# Altium schematic sheet Sheet1.SchDoc
size 549 x 449 mm; SheetNumber: 1; SheetTotal: 1
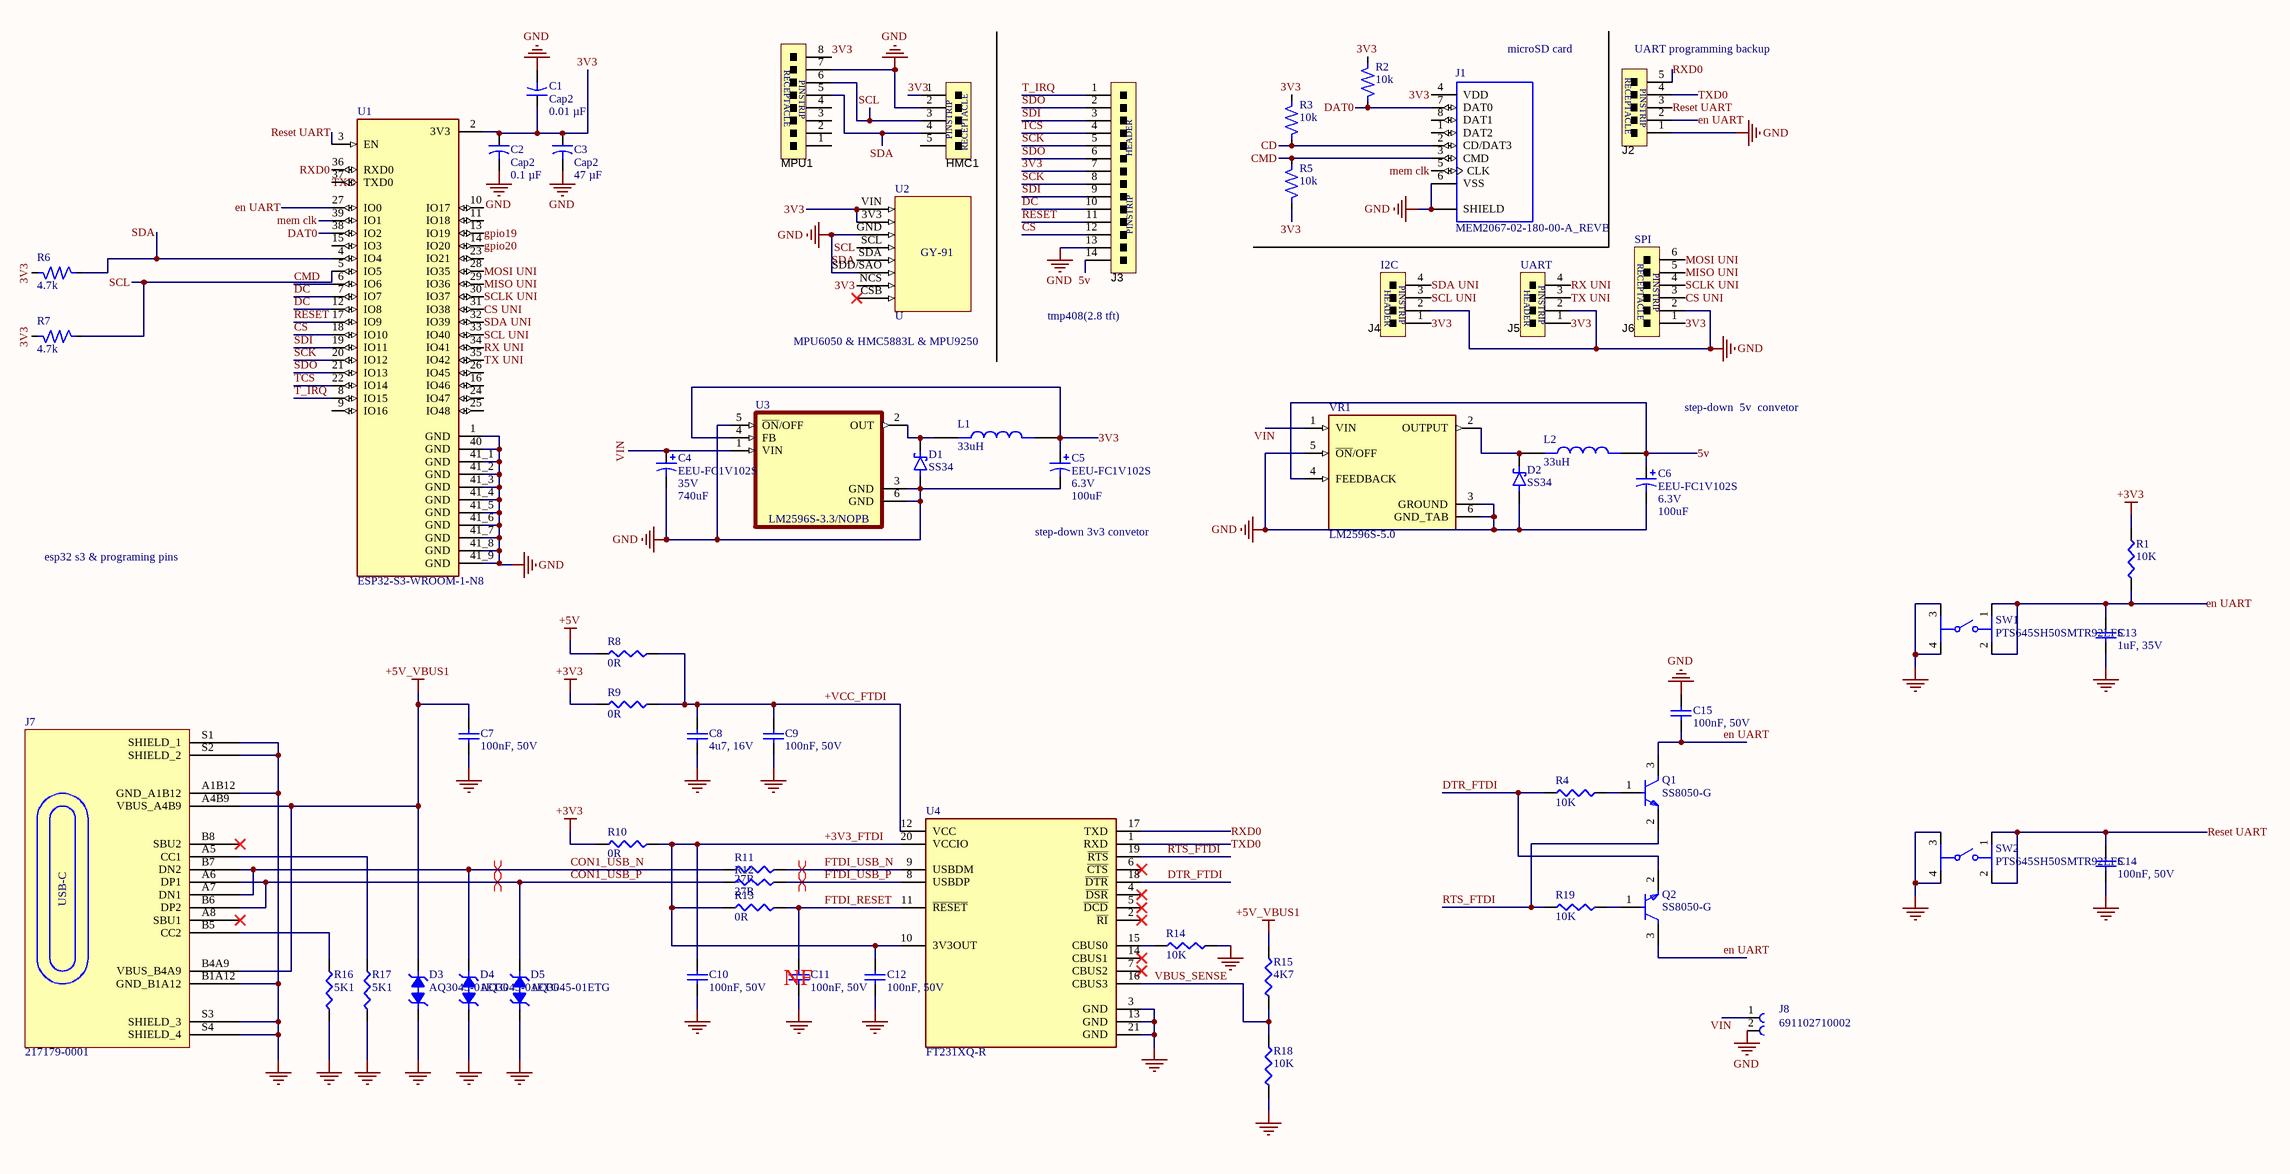
[diagram p0: Sheet1.SchDoc]

## Parts
C1  Cap2  value 0.01 µF  [CAPR5-4X5]
C2  Cap2  value 0.1 µF  [CAPR5-4X5]
C3  Cap2  value 47 µF  [CAPR5-4X5]
C4  EEU-FC1V102S  value 740uF  VoltageDC: 35V  [THRU-KMG-L25]
C5  EEU-FC1V102S  value 100uF  VoltageDC: 6.3V  [THRU-KMG-L25]
C6  EEU-FC1V102S  value 100uF  VoltageDC: 6.3V  [THRU-KMG-L25]
C7  100nF, 50V  [CAPC1005X55N]
C8  4u7, 16V  [CAPC1005X55N]
C9  100nF, 50V  [CAPC1005X55N]
C10  100nF, 50V  [CAPC1005X55N]
C11  100nF, 50V  [CAPC1005X55N]
C12  100nF, 50V  [CAPC1005X55N]
C13  1uF, 35V  [CAPC1005X55N]
C14  100nF, 50V  [CAPC1005X55N]
C15  100nF, 50V  [CAPC1005X55N]
D1  SS34  [DIO_SS34]
D2  SS34  [DIO_SS34]
D3  AQ3045-01ETG  [SOD882]
D4  AQ3045-01ETG  [SOD882]
D5  AQ3045-01ETG  [SOD882]
HMC1  5-534237-3  [PINSTRIP-SINGLE-5PIN-.1]  (value not drawn)
J1  MEM2067-02-180-00-A_REVB  [GCT_MEM2067-02-180-00-A_REVB]
J2  5-534237-3  [PINSTRIP-SINGLE-5PIN-.1]  (value not drawn)
J3  9-146285-0  [PINSTRIP-SINGLE-14PIN-.1]  (value not drawn)
J4  9-146285-0  [PINSTRIP-SINGLE-4PIN-.1]  (value not drawn)
J5  9-146285-0  [PINSTRIP-SINGLE-4PIN-.1]  (value not drawn)
J6  5-534237-4  [PINSTRIP-SINGLE-6PIN-.1]  (value not drawn)
J7  217179-0001  [FP-2171790001-MFG]
J8  691102710002  [*691102710002]
L1  33uH  [IND_FIT68-5]
L2  33uH  [IND_FIT68-5]
MPU1  5-534237-6  [PINSTRIP-SINGLE-8PIN-.1]  (value not drawn)
Q1  SS8050-G  [FP-SS8050-G-IPC_B]
Q2  SS8050-G  [FP-SS8050-G-IPC_B]
R1  10K  [RESC1005X37N]
R2  value 10k  [R0805]  (hidden comment: 1.5kR, 0805)
R3  value 10k  [R0805]  (hidden comment: 1.5kR, 0805)
R4  10K  [RESC1005X37N]
R5  value 10k  [R0805]  (hidden comment: 1.5kR, 0805)
R6  value 4.7k  [R0805]  (hidden comment: 1.5kR, 0805)
R7  value 4.7k  [R0805]  (hidden comment: 1.5kR, 0805)
R8  0R  [RESC1005X37N]
R9  0R  [RESC1005X37N]
R10  0R  [RESC1005X37N]
R11  27R  [RESC1005X37N]
R12  27R  [RESC1005X37N]
R13  0R  [RESC1005X37N]
R14  10K  [RESC1005X37N]
R15  4K7  [RESC1005X37N]
R16  5K1  [RESC1005X37N]
R17  5K1  [RESC1005X37N]
R18  10K  [RESC1005X37N]
R19  10K  [RESC1005X37N]
SW1  PTS645SH50SMTR92LFS  [FP-PTS645SH50SMTR92LFS-MFG]
SW2  PTS645SH50SMTR92LFS  [FP-PTS645SH50SMTR92LFS-MFG]
U1  ESP32-S3-WROOM-1-N8  [XCVR_ESP32-S3-WROOM-1-N8]
U2  U  [GY-91]
U3  LM2596S-3.3/NOPB  [VREG_LM2596S-3.3/NOPB]
U4  FT231XQ-R  [FP-QFN-20-IPC_B]
VR1  LM2596S-5.0  [TO170P1524X483-6N]

## Nets
+3V3: R1.2 R9.1 R10.1
+5V: R8.1
+5V_VBUS1: C7.2 D3.2 J7.A4B9(VBUS_A4B9) J7.B4A9(VBUS_B4A9) R15.2
GND: C1.2 C2.2 C3.2 C4.2 C5.2 C6.2 C7.1 C8.1 C9.1 C10.1 C11.1 C12.1 C13.1 C14.1 C15.2 D1.A D2.A D3.1 D4.1 D5.1 HMC1.2(GND) J1.6(VSS) J1.9(SHIELD) J1.10(SHIELD) J1.11(SHIELD) J1.12(SHIELD) J2.1 J3.13 J4.2 J5.2 J6.2 J7.A1B12(GND_A1B12) J7.B1A12(GND_B1A12) J7.S1(SHIELD_1) J7.S2(SHIELD_2) J7.S3(SHIELD_3) J7.S4(SHIELD_4) J8.2 MPU1.7 R14.2 R16.1 R17.1 R18.2 SW1.3 SW1.4 SW2.3 SW2.4 U1.1(GND) U1.40(GND) U1.41_1(GND) U1.41_2(GND) U1.41_3(GND) U1.41_4(GND) U1.41_5(GND) U1.41_6(GND) U1.41_7(GND) U1.41_8(GND) U1.41_9(GND) U2.GND U2.SDD/SAO U3.3(GND) U3.5(~{ON}/OFF) U3.6(GND) U4.3(GND) U4.13(GND) U4.21(GND) VR1.3(GROUND) VR1.5(~{ON}/OFF) VR1.6(GND_TAB)
3V3: C1.1 C2.1 C3.1 C5.1 HMC1.1(Vcc) J1.4(VDD) J3.7 J4.1 J5.1 J6.1 L1.2 MPU1.8 R2.2 R3.2 R5.1 R6.1 R7.1 U1.2(3V3) U2.3V3 U2.NCS U2.VIN U3.4(FB)
5v: C6.1 J3.14 L2.2 VR1.4(FEEDBACK)
+3V3_FTDI: C10.2 C12.2 R10.2 R13.1 U4.10(3V3OUT) U4.20(VCCIO)
+VCC_FTDI: C8.2 C9.2 R8.2 R9.2 U4.12(VCC)
CD: J1.2(CD/DAT3) R3.1
CMD: J1.3(CMD) R5.2 U1.6(IO6)
CON1_USB_N: D4.2 J7.A7(DN1) J7.B7(DN2) R11.1
CON1_USB_P: D5.2 J7.A6(DP1) J7.B6(DP2) R12.1
CS: J3.12 U1.18(IO10)
CS UNI: J6.3 U1.31(IO38)
DAT0: J1.7(DAT0) R2.1 U1.38(IO2)
DC: J3.10 U1.7(IO7) U1.12(IO8)
DTR_FTDI: Q2.2(E) R4.1 U4.18(~{DTR})
en UART: C13.2 C15.1 J2.2 Q1.3(C) Q2.3(C) R1.1 SW1.1 SW1.2 U1.27(IO0)
FTDI_RESET: C11.2 R13.2 U4.11(~{RESET})
FTDI_USB_N: R11.2 U4.9(USBDM)
FTDI_USB_P: R12.2 U4.8(USBDP)
gpio19: U1.13(IO19)
gpio20: U1.14(IO20)
mem clk: J1.5(CLK) U1.39(IO1)
MISO UNI: J6.5 U1.29(IO36)
MOSI UNI: J6.6 U1.28(IO35)
RESET: J3.11 U1.17(IO9)
Reset UART: C14.2 J2.3 SW2.1 SW2.2 U1.3(EN)
RTS_FTDI: Q1.2(E) R19.1 U4.19(~{RTS})
RX UNI: J5.4 U1.34(IO41)
RXD0: J2.5 U1.36(RXD0) U4.17(TXD)
SCK: J3.5 J3.8 U1.20(IO12)
SCL: HMC1.3(SCL) MPU1.6 R7.2 U1.5(IO5) U2.SCL
SCL UNI: J4.3 U1.33(IO40)
SCLK UNI: J6.4 U1.30(IO37)
SDA: HMC1.4(SDA) MPU1.5 R6.2 U1.4(IO4) U2.SDA
SDA UNI: J4.4 U1.32(IO39)
SDI: J3.3 J3.9 U1.19(IO11)
SDO: J3.2 J3.6 U1.21(IO13)
T_IRQ: J3.1 U1.8(IO15)
TCS: J3.4 U1.22(IO14)
TX UNI: J5.3 U1.35(IO42)
TXD0: J2.4 U1.37(TXD0) U4.1(RXD)
VBUS_SENSE: R15.1 R18.1 U4.16(CBUS3)
VIN: C4.1 J8.1 U3.1(VIN) VR1.1(VIN)
NetD1_C: D1.C(K) L1.1 U3.2(OUT)
NetD2_C: D2.C(K) L2.1 VR1.2(OUTPUT)
NetJ7_A5: J7.A5(CC1) R17.2
NetJ7_B5: J7.B5(CC2) R16.2
NetQ1_1: Q1.1(B) R4.2
NetQ2_1: Q2.1(B) R19.2
NetR14_1: R14.1 U4.15(CBUS0)

Not connected (* = marked no-connect by the designer): HMC1 5(DRDY); J1 1(DAT2) 8(DAT1); J7 A8(SBU1)* B8(SBU2)*; MPU1 1 2 3 4; U1 9(IO16) 10(IO17) 11(IO18) 15(IO3) 16(IO46) 23(IO21) 24(IO47) 25(IO48) 26(IO45); U2 CSB*; U4 2(~{RI})* 4(~{DSR})* 5(~{DCD})* 6(~{CTS})* 7(CBUS2)* 14(CBUS1)*

## Layout directives
differential pair; differential pair class DIFF90: CON1_USB_N, CON1_USB_P, FTDI_USB_N, FTDI_USB_P

## Notes on the sheet
- microSD card
- (near J2) UART programming backup
- (near J4) I2C
- (near J5) UART
- (near J6) SPI
- (near U2) MPU6050 & HMC5883L & MPU9250
- tmp408(2.8 tft)
- step-down  5v  convetor
- step-down 3v3 convetor
- esp32 s3 & programing pins
- (near C11) NF
- (in symbol 217179-0001) USB-C
- (in symbol PINSTRIP-HDR-SINGLE-4pin) HEADER; PINSTRIP
- (in symbol PINSTRIP-HDR-SINGLE-14pin) HEADER; PINSTRIP
- (in symbol PINSTRIP-RCPT-SINGLE-5pin) PINSTRIP; RECEPTACLE
- (in symbol PINSTRIP-RCPT-SINGLE-6pin) RECEPTACLE; PINSTRIP
- (in symbol PINSTRIP-RCPT-SINGLE-8pin) RECEPTACLE; PINSTRIP

## Library data of the parts
C1-C3 = Cap2: Capacitor; Published: 23-Sep-2002; PackageReference: CAPR5-4X5; Publisher: Altium Limited; PackageDescription: Capacitor; 2 Leads
C4-C6 = 1000uF: 1000uF, Alum Electrolytic Capacitor, 35V, 16mm x 20mm, lead spacing 7.5mm; Manufacturer: Panasonic; Impedance: 29mOhm; Part Number: EEU-FC1V102S; PackageDescription: Aluminum Electrolytic Capacitor; Temperature: -55C to 105C; Voltage (DC): *; Supplier 1: Digi-Key; Supplier Part Number 1: P10876-ND; Supplier 2: Newark; Supplier Part Number 2: 17T5114; Supplier 3: Mouser; Supplier Part Number 3: 667-EEU-FC1V102SB; Package Reference: Thru-Hole, 7.5mm
C7 C9-C12 C14 C15 = CL05B104KB54PNC: CAP CER 0.1UF 50V X7R 0402; Manufacturer: Samsung; Dielectric Material: Ceramic; Supplier: Digikey; Supplier Part Number: 1276-CL05B104KB54PNCCT-ND; Manufacturer Part Number: CL05B104KB54PNC; RoHS: Yes; Category: Ceramic Capacitors; Stock: 1237875; Pricing: 1=0.1, 10=0.044, 50=0.025, 100=0.0194, 500=0.0146, 1000=0.01147, 2500=0.01043, 5000=0.00959 (USD); Pins: 2; Capacitor Type: Ceramic; RoHS Compliant: Yes; Reach SVHC Compliant: Yes; ComponentLink1URL: https://datasheet.ciiva.com:443/pdfs/VipMasterIC/IC/SEMS/SEMS-S-A0006318249/SEMS-S-A0006320959-1.pdf?src-supplier=IHS+Markit; ComponentLink1Description: https://datasheet.ciiva.com:443/pdfs/VipMasterIC/IC/SEMS/SEMS-S-A0006318249/SEMS-S-A0006320959-1.pdf?src-supplier=IHS+Markit; ComponentLink2URL: https://datasheet.octopart.com/CL05B104KB54PNC-Samsung-datasheet-8326407.pdf?src-supplier=TME; ComponentLink2Description: https://datasheet.octopart.com/CL05B104KB54PNC-Samsung-datasheet-8326407.pdf?src-supplier=TME; LCSC Part Number: C307331
C8 = CL05A475MO5NUNC: CAP CER 4.7UF 16V X5R 0402; Manufacturer: Samsung; Dielectric Material: Ceramic; Multilayer: Yes; Tolerance  (fill in as +-): 20%; Supplier: Digikey; Supplier Part Number: 1276-6836-1-ND; Manufacturer Part Number: CL05A475MO5NUNC; RoHS: Yes; Category: Ceramic Capacitors; Stock: 647617; Pricing: 1=0.44, 10=0.293, 50=0.216, 100=0.1759, 500=0.13888, 1000=0.11727, 2500=0.1111, 5000=0.10493 (USD); Mounting Technology: Surface Mount; Pins: 2; Package Shape: Rectangular; Case/Package: 0402; Terminal Finish: Nickel; Min Operating Temperature: -55°C; Max Operating Temperature: 85°C; JESD-609 Code: e3; Value: 4.7uF; Capacitor Type: Ceramic; Package Style: SMTMeter; Packaging: Tape and Reel; Tolerance (fill in as +-): 20%; Rated DC Voltage (URdc): 16V; Temperature Characteristics Code: X5R; Termination: Wraparound; Length: 1mm; Width: 0.5mm; Height: 0.7mm; Reach SVHC Compliant: Yes; RoHS Compliant: Yes; ComponentLink1URL: https://datasheet.ciiva.com:443/pdfs/VipMasterIC/IC/SEMS/SEMS-S-A0008384515/SEMS-S-A0008898881-1.pdf?src-supplier=IHS+Markit; ComponentLink1Description: https://datasheet.ciiva.com:443/pdfs/VipMasterIC/IC/SEMS/SEMS-S-A0008384515/SEMS-S-A0008898881-1.pdf?src-supplier=IHS+Markit; ComponentLink2URL: http://www.farnell.com/datasheets/2710653.pdf?src-supplier=Farnell; ComponentLink2Description: http://www.farnell.com/datasheets/2710653.pdf?src-supplier=Farnell; ComponentLink3URL: http://www.samsungsem.com/kr/support/product-search/mlcc/CL05A475MO5NUNC.jsp?src-supplier=Digikey; ComponentLink3Description: http://www.samsungsem.com/kr/support/product-search/mlcc/CL05A475MO5NUNC.jsp?src-supplier=Digikey; ComponentLink4URL: http://www.farnell.com/datasheets/2710653.pdf?src-supplier=Newark; ComponentLink4Description: http://www.farnell.com/datasheets/2710653.pdf?src-supplier=Newark; ComponentLink5URL: http://www.farnell.com/datasheets/2710653.pdf?src-supplier=Element14; ComponentLink5Description: http://www.farnell.com/datasheets/2710653.pdf?src-supplier=Element14; ComponentLink6URL: https://datasheet.octopart.com/CL05A475MO5NUNC-Samsung-Electro-Mechanics-datasheet-123102911.pdf?src-supplier=Future+Electronics; ComponentLink6Description: https://datasheet.octopart.com/CL05A475MO5NUNC-Samsung-Electro-Mechanics-datasheet-123102911.pdf?src-supplier=Future+Electronics; LCSC Part Number: C318563
C13 = CL05A105KL5NRNC: CAP CER 1UF 35V X5R 0402; Manufacturer: Samsung; Dielectric Material: Ceramic; Multilayer: Yes; Tolerance  (fill in as +-): 10%; Supplier: Digikey; Supplier Part Number: 1276-6796-1-ND; Manufacturer Part Number: CL05A105KL5NRNC; RoHS: Yes; Category: Ceramic Capacitors; Stock: 469958; Pricing: 1=0.33, 10=0.212, 50=0.149, 100=0.1202, 500=0.08934, 1000=0.07818, 2500=0.07446, 5000=0.06887 (USD); Mounting Technology: Surface Mount; Pins: 2; Package Shape: Rectangular; Case/Package: 0402; Terminal Finish: Nickel; Min Operating Temperature: -55°C; Max Operating Temperature: 85°C; JESD-609 Code: e3; Value: 1uF; Capacitor Type: Ceramic; Packaging: Tape and Reel; Tolerance (fill in as +-): 10%; Rated DC Voltage (URdc): 35V; Temperature Characteristics Code: X5R; Termination: Wraparound; Reach SVHC Compliant: Yes; RoHS Compliant: Yes; ComponentLink1URL: https://datasheet.ciiva.com:443/pdfs/VipMasterIC/IC/SEMS/SEMS-S-A0008384515/SEMS-S-A0008872905-1.pdf?src-supplier=IHS+Markit; ComponentLink1Description: https://datasheet.ciiva.com:443/pdfs/VipMasterIC/IC/SEMS/SEMS-S-A0008384515/SEMS-S-A0008872905-1.pdf?src-supplier=IHS+Markit; ComponentLink2URL: http://www.samsungsem.com/kr/support/product-search/mlcc/CL05A105KL5NRNC.jsp?src-supplier=Digikey; ComponentLink2Description: http://www.samsungsem.com/kr/support/product-search/mlcc/CL05A105KL5NRNC.jsp?src-supplier=Digikey; LCSC Part Number: C307413
D1 D2 = SS34: 3A, 40V, Schottky Rectifier; MF: Taiwan Semiconductor; SnapEDA_Link: https://www.snapeda.com/parts/SS34/Taiwan+Semiconductor/view-part/?ref=snap; Package: DO-214AB-2 Taiwan Semiconductor; Value: *; MP: SS34; Check_prices: https://www.snapeda.com/parts/SS34/Taiwan+Semiconductor/view-part/?ref=eda
D3-D5 = AQ3045-01ETG: TVS DIODE 5.3VWM 12VC SOD882; Manufacturer: Littelfuse; Diode Element Material: SILICON; Package Body Material: Plastic; Polarity: Bidirectional; Max Breakdown Voltage: 9V; Min Breakdown Voltage: 6.8V; Diode Type: TRANS VOLTAGE SUPPRESSOR; Non-rep Peak Rev Power Dis-Max: 40W; Number of Elements: 1; Rep Pk Reverse Voltage-Max: 5.3V; Reference Standard: AEC-Q101; Supplier: Digikey; Supplier Part Number: F9321CT-ND; Manufacturer Part Number: AQ3045-01ETG; RoHS: Yes; Category: TVS Diodes; Stock: 21664; Pricing: 1=0.5, 10=0.391, 100=0.2344, 500=0.217, 1000=0.14756, 2000=0.13585, 5000=0.1302 (USD); Pins: 2; Package Shape: Rectangular; Min Operating Temperature: -55°C; Max Operating Temperature: 150°C; Package Style: CHIP CARRIERMeter; Surface Mount: Yes; Technology: AVALANCHE; Terminal Form: No Lead; Terminal Position: BOTTOM; Reach SVHC Compliant: Yes; RoHS Compliant: Yes; ComponentLink1URL: https://datasheet.ciiva.com:443/pdfs/VipMasterIC/IC/LFSI/LFSI-S-A0007892042/LFSI-S-A0007892042-1.pdf?src-supplier=IHS+Markit; ComponentLink1Description: https://datasheet.ciiva.com:443/pdfs/VipMasterIC/IC/LFSI/LFSI-S-A0007892042/LFSI-S-A0007892042-1.pdf?src-supplier=IHS+Markit; ComponentLink2URL: https://www.littelfuse.com/~/media/electronics/datasheets/tvs_diode_arrays/littelfuse_tvs_diode_array_aq3045_datasheet.pdf.pdf?src-supplier=Digikey; ComponentLink2Description: https://www.littelfuse.com/~/media/electronics/datasheets/tvs_diode_arrays/littelfuse_tvs_diode_array_aq3045_datasheet.pdf.pdf?src-supplier=Digikey; ComponentLink3URL: http://www.littelfuse.com/~/media/electronics/datasheets/tvs_diode_arrays/littelfuse_tvs_diode_array_aq3045_datasheet.pdf.pdf?src-supplier=Digikey; ComponentLink3Description: http://www.littelfuse.com/~/media/electronics/datasheets/tvs_diode_arrays/littelfuse_tvs_diode_array_aq3045_datasheet.pdf.pdf?src-supplier=Digikey; LCSC Part Number: C3710326
HMC1 J2 = PINSTRIP-RCPT-SINGLE-5pin: 5 Pin Receptacle, Single row, 2.54mm pitch, Vertical; Manufacturer: TE Connectivity; Pitch: 0.100" (2.54mm); Rows: 1; Mates With (PCB): PINSTRIP-HDR-SINGLE-5pin; Connector Height: 320 mil; Mounting Type: Through Hole; PackageDescription: Pin Receptacle; 2.54mm pitch; Part Number: 5-534237-3; Pins: 5; Mates With (Wire housing): N/A; Supplier 1: Mouser; Supplier Part Number 1: 571-5-534237-3; Supplier 2: Newark; Supplier Part Number 2: 18R9351; Supplier 3: Digi-Key; Supplier Part Number 3: A32906-ND
J1 = MEM2067-02-180-00-A_REVB: Micro SD Memory Card ConnectorSMT, Hinged, 1.80mm Profile; Price: None; Value: *; MP: MEM2067-02-180-00-A_REVB; Package: None; Availability: Unavailable
J3 = PINSTRIP-HDR-SINGLE-14pin: 14 Pin Header, Single row, 2.54mm pitch, Unshrouded Pin Strip, Vertical; Manufacturer: TE Connectivity; Part Number: 14/40 of 9-146285-0; Pitch: 0.100" (2.54mm); Rows: 1; Mates With (PCB): 6-534237-2; Mates With (Wire housing): 50-57-9014 (MOLEX Part, Uses crimp terminal series 70058, 71851, 70021); Connector Height: 320 mil; Mounting Type: Through Hole; PackageDescription: Pin header; 2.54mm pitch; Pins: 14; Supplier 1: Digi-Key; Supplier 2: Newark; Supplier 3: Mouser; Supplier Part Number 1: A32700-40-ND; Supplier Part Number 2: 16M3463; Supplier Part Number 3: 571-9-146285-0
J4 J5 = PINSTRIP-HDR-SINGLE-4pin: 4 Pin Header, Single row, 2.54mm pitch, Unshrouded Pin Strip, Vertical; Manufacturer: TE Connectivity; Part Number: 04/40 of 9-146285-0; Pitch: 0.100" (2.54mm); Rows: 1; Mates With (PCB): 5-534237-2; Mates With (Wire housing): 50-57-9004 (MOLEX Part, Uses crimp terminal series 70058, 71851, 70021); Connector Height: 320 mil; Mounting Type: Through Hole; PackageDescription: Pin header; 2.54mm pitch; Pins: 4; Supplier 1: Digi-Key; Supplier 2: Newark; Supplier 3: Mouser; Supplier Part Number 1: A32700-40-ND; Supplier Part Number 2: 16M3463; Supplier Part Number 3: 571-9-146285-0
J6 = PINSTRIP-RCPT-SINGLE-6pin: 6 Pin Receptacle, Single row, 2.54mm pitch, Vertical; Manufacturer: TE Connectivity; Pitch: 0.100" (2.54mm); Rows: 1; Mates With (PCB): PINSTRIP-HDR-SINGLE-6pin; Connector Height: 320 mil; Mounting Type: Through Hole; PackageDescription: Pin Receptacle; 2.54mm pitch; Part Number: 5-534237-4; Pins: 6; Mates With (Wire housing): N/A; Supplier 1: Digi-Key; Supplier Part Number 1: A32907-ND; Supplier 2: Newark; Supplier Part Number 2: 62M8851; Supplier 3: Mouser; Supplier Part Number 3: 571-5-534237-4
J7 = 217179-0001: CONN RCP USB2.0 TYP C 24P SMD RA; Manufacturer: Molex; Supplier: Digikey; Supplier Part Number: 900-2171790001CT-ND; Manufacturer Part Number: 217179-0001; RoHS: No; Category: Connectors; Stock: 7228; Pricing: 1=0.9, 10=0.745, 100=0.6212 (USD); LCSC Part Number: C3197684
J8 = 691102710002: 102 Series 5mm Pitch Straight, PCB Terminal Block, Through Hole, 2 Way; MF: Wurth Electronics; Package: None; MP: 691102710002; SnapEDA_Link: https://www.snapeda.com/parts/691102710002/Wurth%20Electronics%20Inc./view-part/?ref=snap; Availability: Unavailable; Price: None; Value: *
L1 L2 = FIT68-5: 33.15 ÂµH Unshielded Toroidal Inductor 5.7 A 28.8mOhm Max Radial, Vertical (Open); MF: Triad Magnetics; SnapEDA_Link: https://www.snapeda.com/parts/FIT68-5/Triad+Magnetics/view-part/?ref=snap; Package: None; Value: *; MP: FIT68-5; Check_prices: https://www.snapeda.com/parts/FIT68-5/Triad+Magnetics/view-part/?ref=eda
MPU1 = PINSTRIP-RCPT-SINGLE-8pin: 8 Pin Receptacle, Single row, 2.54mm pitch, Vertical; Manufacturer: TE Connectivity; Pitch: 0.100" (2.54mm); Rows: 1; Mates With (PCB): PINSTRIP-HDR-SINGLE-8pin; Connector Height: 320 mil; Mounting Type: Through Hole; PackageDescription: Pin Receptacle; 2.54mm pitch; Part Number: 5-534237-6; Pins: 8; Mates With (Wire housing): N/A; Supplier 1: Newark; Supplier Part Number 1: 52K3745; Supplier 2: Mouser; Supplier Part Number 2: 571-5-534237-6; Supplier 3: Digi-Key; Supplier Part Number 3: A32909-ND
Q1 Q2 = SS8050-G: TRANS NPN 25V 1.5A SOT23-3; Manufacturer: Comchip; Supplier: Digikey; Supplier Part Number: 641-1790-1-ND; Manufacturer Part Number: SS8050-G; RoHS: Yes; Category: Transistors; Stock: 108568; Pricing: 1=0.29, 10=0.2, 100=0.0978, 500=0.08154, 1000=0.05666 (USD); Reach SVHC Compliant: Yes; RoHS Compliant: Yes; ComponentLink1URL: https://datasheet.ciiva.com:443/pdfs/VipMasterIC/IC/COMC/COMC-S-A0004994192/COMC-S-A0004994192-1.pdf?src-supplier=IHS+Markit; ComponentLink1Description: https://datasheet.ciiva.com:443/pdfs/VipMasterIC/IC/COMC/COMC-S-A0004994192/COMC-S-A0004994192-1.pdf?src-supplier=IHS+Markit; ComponentLink2URL: http://www.comchiptech.com/admin/files/product/SS8050-G RevA181526.pdf?src-supplier=Digikey; ComponentLink2Description: http://www.comchiptech.com/admin/files/product/SS8050-G RevA181526.pdf?src-supplier=Digikey; LCSC Part Number: C164886
R1 R4 R14 R18 R19 = AC0402FR-0710KL: RES SMD 10K OHM 1% 1/16W 0402; Manufacturer: Yageo; Additional Feature: LASER TRIMMABLE; Power: 62.5mW; Rated Temperature: 70°C; Value: 10kR; Temperature Coefficient: 100ppm/°C; Working Voltage: 50V; Package Height: 0.32mm; Package Length: 1mm; Package Width: 0.5mm; Reference Standard: AEC-Q200; Supplier: Digikey; Supplier Part Number: YAG3436CT-ND; Manufacturer Part Number: AC0402FR-0710KL; RoHS: Yes; Category: Chip SMD Resistors; Stock: 1122213; Pricing: 1=0.1, 10=0.019, 50=0.0116, 100=0.0095, 500=0.00638, 1000=0.00544, 5000=0.00391 (USD); Mounting Technology: Surface Mount; Pins: 2; Package Shape: Rectangular; Case/Package: 0402; Terminal Finish: Nickel; Min Operating Temperature: -55°C; Max Operating Temperature: 155°C; Tolerance: 1%; JESD-609 Code: e3; Resistor Type: FIXED RESISTOR; Construction: Chip; Package Style: SMTMeter; Packaging: Tape and Reel; Technology: METAL GLAZE/THICK FILM; Termination: Wraparound; Reach SVHC Compliant: Yes; RoHS Compliant: Yes; ComponentLink1URL: https://datasheet.ciiva.com:443/pdfs/VipMasterIC/IC/YAGO/YAGO-S-A0003597364/YAGO-S-A0003597364-1.pdf?src-supplier=IHS+Markit; ComponentLink1Description: https://datasheet.ciiva.com:443/pdfs/VipMasterIC/IC/YAGO/YAGO-S-A0003597364/YAGO-S-A0003597364-1.pdf?src-supplier=IHS+Markit; ComponentLink2URL: https://datasheet.ciiva.com/12656/pyu-ac-51-rohs-l-2-12656634.pdf?src-supplier=Mouser; ComponentLink2Description: https://datasheet.ciiva.com/12656/pyu-ac-51-rohs-l-2-12656634.pdf?src-supplier=Mouser; LCSC Part Number: C144807
R2 R3 R5-R7 = 1.5kR-0805: 1.5kR, 0805 SMT resistor, 1/8W, 1%; PackageDescription: Chip Resistor 0805; Supplier 1: Newark; Supplier 2: Mouser; Supplier 3: Digi-Key; Supplier Part Number 1: 52K9744; Supplier Part Number 2: 71-CRCW0805-1.5K-E3; Supplier Part Number 3: 541-1.50KCCT-ND; Package Reference: 0805
R8-R10 R13 = RC0402JR-070RL: RES 0 OHM JUMPER 1/16W 0402; Manufacturer: Yageo; Power: 62.5mW; Rated Temperature: 70°C; Package Height: 0.35mm; Package Length: 1mm; Package Width: 0.5mm; Supplier: Digikey; Supplier Part Number: 311-0.0JRCT-ND; Manufacturer Part Number: RC0402JR-070RL; RoHS: Yes; Category: Chip SMD Resistors; Stock: 5988729; Pricing: 1=0.1, 10=0.011, 25=0.0084, 50=0.0064, 100=0.0045, 250=0.00364, 500=0.0029, 1000=0.00214, 5000=0.00154 (USD); Mounting Technology: Surface Mount; Pins: 2; Package Shape: Rectangular; Case/Package: 0402; Terminal Finish: Nickel; Min Operating Temperature: -55°C; Max Operating Temperature: 155°C; JESD-609 Code: e3; Resistor Type: FIXED RESISTOR; Construction: Chip; Package Style: SMTMeter; Packaging: Tape and Reel; Value: 0R; Technology: METAL GLAZE/THICK FILM; Termination: Wraparound; Reach SVHC Compliant: Yes; RoHS Compliant: Yes; ComponentLink1URL: https://datasheet.ciiva.com:443/pdfs/VipMasterIC/IC/YAGO/YAGO-S-A0008145938/YAGO-S-A0008145938-1.pdf?src-supplier=IHS+Markit; ComponentLink1Description: https://datasheet.ciiva.com:443/pdfs/VipMasterIC/IC/YAGO/YAGO-S-A0008145938/YAGO-S-A0008145938-1.pdf?src-supplier=IHS+Markit; LCSC Part Number: C60485
R11 R12 = RC0402FR-0727RL: RES 27 OHM 1% 1/16W 0402; Manufacturer: Yageo; Additional Feature: LASER TRIMMABLE; Power: 62.5mW; Rated Temperature: 70°C; Temperature Coefficient: 100ppm/°C; Working Voltage: 50V; Package Height: 0.35mm; Package Length: 1mm; Package Width: 0.5mm; Supplier: Digikey; Supplier Part Number: YAG3086CT-ND; Manufacturer Part Number: RC0402FR-0727RL; RoHS: Yes; Category: Chip SMD Resistors; Stock: 423061; Pricing: 1=0.1, 10=0.015, 50=0.0088, 100=0.0073, 500=0.00488, 1000=0.00417, 5000=0.00297 (USD); Mounting Technology: Surface Mount; Pins: 2; Package Shape: Rectangular; Case/Package: 0402; Terminal Finish: Nickel; Min Operating Temperature: -55°C; Max Operating Temperature: 155°C; Tolerance: 1%; JESD-609 Code: e3; Resistor Type: FIXED RESISTOR; Construction: Chip; Package Style: SMTMeter; Packaging: Tape and Reel; Value: 27R; Technology: METAL GLAZE/THICK FILM; Termination: Wraparound; Reach SVHC Compliant: Yes; RoHS Compliant: Yes; ComponentLink1URL: https://datasheet.ciiva.com:443/pdfs/VipMasterIC/IC/YAGO/YAGO-S-A0008145938/YAGO-S-A0008145938-1.pdf?src-supplier=IHS+Markit; ComponentLink1Description: https://datasheet.ciiva.com:443/pdfs/VipMasterIC/IC/YAGO/YAGO-S-A0008145938/YAGO-S-A0008145938-1.pdf?src-supplier=IHS+Markit; ComponentLink2URL: https://datasheet.ciiva.com/11808/0900766b80c66297-11808450.pdf?src-supplier=Rs; ComponentLink2Description: https://datasheet.ciiva.com/11808/0900766b80c66297-11808450.pdf?src-supplier=Rs; ComponentLink3URL: https://datasheet.ciiva.com/7849/1018594-7849927.pdf?src-supplier=Element14; ComponentLink3Description: https://datasheet.ciiva.com/7849/1018594-7849927.pdf?src-supplier=Element14; ComponentLink4URL: https://datasheet.ciiva.com/7849/1018594-7849926.pdf?src-supplier=Element14; ComponentLink4Description: https://datasheet.ciiva.com/7849/1018594-7849926.pdf?src-supplier=Element14; LCSC Part Number: C138021
R15 = RC0402FR-074K7L: RES 4.7K OHM 1% 1/16W 0402; Manufacturer: Yageo; Additional Feature: LASER TRIMMABLE; Power: 62.5mW; Rated Temperature: 70°C; Value: 4.7kR; Temperature Coefficient: 100ppm/°C; Working Voltage: 50V; Package Height: 0.35mm; Package Length: 1mm; Package Width: 0.5mm; Supplier: Digikey; Supplier Part Number: 311-4.7KLRCT-ND; Manufacturer Part Number: RC0402FR-074K7L; RoHS: Yes; Category: Chip SMD Resistors; Stock: 9886878; Pricing: 1=0.1, 10=0.015, 50=0.0088, 100=0.0073, 500=0.00488, 1000=0.00417, 5000=0.00297 (USD); Mounting Technology: Surface Mount; Pins: 2; Package Shape: Rectangular; Case/Package: 0402; Terminal Finish: Nickel; Min Operating Temperature: -55°C; Max Operating Temperature: 155°C; Tolerance: 1%; JESD-609 Code: e3; Resistor Type: FIXED RESISTOR; Construction: Chip; Package Style: SMTMeter; Packaging: Tape and Reel; Technology: METAL GLAZE/THICK FILM; Termination: Wraparound; Reach SVHC Compliant: Yes; RoHS Compliant: Yes; ComponentLink1URL: https://datasheet.ciiva.com:443/pdfs/VipMasterIC/IC/YAGO/YAGO-S-A0008145938/YAGO-S-A0008145938-1.pdf?src-supplier=IHS+Markit; ComponentLink1Description: https://datasheet.ciiva.com:443/pdfs/VipMasterIC/IC/YAGO/YAGO-S-A0008145938/YAGO-S-A0008145938-1.pdf?src-supplier=IHS+Markit; ComponentLink2URL: https://datasheet.ciiva.com/22661/1686128-22661342.pdf?src-supplier=Element14; ComponentLink2Description: https://datasheet.ciiva.com/22661/1686128-22661342.pdf?src-supplier=Element14; ComponentLink3URL: https://datasheet.ciiva.com/7850/1018594-7850022.pdf?src-supplier=Element14; ComponentLink3Description: https://datasheet.ciiva.com/7850/1018594-7850022.pdf?src-supplier=Element14; ComponentLink4URL: https://datasheet.ciiva.com/7850/1018594-7850023.pdf?src-supplier=Element14; ComponentLink4Description: https://datasheet.ciiva.com/7850/1018594-7850023.pdf?src-supplier=Element14; ComponentLink5URL: https://datasheet.ciiva.com/15215/getdatasheetpartid-328119-15215035.pdf?src-supplier=Verical; ComponentLink5Description: https://datasheet.ciiva.com/15215/getdatasheetpartid-328119-15215035.pdf?src-supplier=Verical; LCSC Part Number: C105871
R16 R17 = AC0402FR-075K1L: RES SMD 5.1K OHM 1% 1/16W 0402; Manufacturer: Yageo; Additional Feature: LASER TRIMMABLE; Power: 62.5mW; Rated Temperature: 70°C; Value: 5.1kR; Temperature Coefficient: 100ppm/°C; Working Voltage: 50V; Package Height: 0.32mm; Package Length: 1mm; Package Width: 0.5mm; Reference Standard: AEC-Q200; Supplier: Digikey; Supplier Part Number: YAG3503CT-ND; Manufacturer Part Number: AC0402FR-075K1L; RoHS: Yes; Category: Chip SMD Resistors; Stock: 164969; Pricing: 1=0.1, 10=0.019, 50=0.0116, 100=0.0095, 500=0.00638, 1000=0.00544, 5000=0.00391 (USD); Mounting Technology: Surface Mount; Pins: 2; Package Shape: Rectangular; Case/Package: 0402; Terminal Finish: Nickel; Min Operating Temperature: -55°C; Max Operating Temperature: 155°C; Tolerance: 1%; JESD-609 Code: e3; Resistor Type: FIXED RESISTOR; Construction: Chip; Package Style: SMTMeter; Packaging: Tape and Reel; Technology: METAL GLAZE/THICK FILM; Termination: Wraparound; Reach SVHC Compliant: Yes; RoHS Compliant: Yes; ComponentLink1URL: https://datasheet.ciiva.com:443/pdfs/VipMasterIC/IC/YAGO/YAGO-S-A0003597364/YAGO-S-A0003597364-1.pdf?src-supplier=IHS+Markit; ComponentLink1Description: https://datasheet.ciiva.com:443/pdfs/VipMasterIC/IC/YAGO/YAGO-S-A0003597364/YAGO-S-A0003597364-1.pdf?src-supplier=IHS+Markit; ComponentLink2URL: https://datasheet.octopart.com/AC0402FR-075K1L-Yageo-datasheet-166720450.pdf?src-supplier=Future+Electronics; ComponentLink2Description: https://datasheet.octopart.com/AC0402FR-075K1L-Yageo-datasheet-166720450.pdf?src-supplier=Future+Electronics; ComponentLink3URL: http://www.yageo.com/documents/recent/PYu-AC_51_RoHS_L_2_revised.pdf?src-supplier=Future+Electronics; ComponentLink3Description: http://www.yageo.com/documents/recent/PYu-AC_51_RoHS_L_2_revised.pdf?src-supplier=Future+Electronics; LCSC Part Number: C144745
SW1 SW2 = PTS645SH50SMTR92LFS: SWITCH TACTILE SPST-NO 0.05A 12V; Manufacturer: ITT C&K; Manufacturer Series: PTS645; Actuator Type: Pushbutton; Contact Current(DC)-Max: 50mA; Contact DC Max Rating R Load: 0.05A@12VDC; Contact Resistance: 0.1mR; Dielectric Withstand Volts: 250VACV; Electrical Life: 100000Cycles; Insulation Resistance: 100GR; PCB Hole Count: 4; Switch Action: MOMENTARY; Switch Function: SPST; Switch Type: Keypad; Body Breadth: 5.9944inch; Body Height: 3.4544mm; Body Length or Diameter: 5.9944mm; Supplier: Digikey; Supplier Part Number: CKN9085CT-ND; Manufacturer Part Number: PTS645SH50SMTR92LFS; RoHS: Yes; Category: Tactile Switches; Stock: 64637; Pricing: 1=0.35, 10=0.337, 25=0.3172, 100=0.2753, 250=0.24972, 500=0.2323 (USD); Mounting Technology: Surface Mount; Terminal Finish: Silver; Min Operating Temperature: -20°C; Max Operating Temperature: 60°C; JESD-609 Code: e4; Contact Voltage(DC)-Max: 12V; Termination: Solder; Terminal Length: 0.138inch; Reach SVHC Compliant: Yes; RoHS Compliant: Yes; ComponentLink1URL: https://datasheet.ciiva.com:443/pdfs/VipMasterIC/IC/CKCI/CKCI-S-A0001796527/CKCI-S-A0001796842-1.pdf?src-supplier=IHS+Markit; ComponentLink1Description: https://datasheet.ciiva.com:443/pdfs/VipMasterIC/IC/CKCI/CKCI-S-A0001796527/CKCI-S-A0001796842-1.pdf?src-supplier=IHS+Markit; ComponentLink2URL: https://datasheet.ciiva.com/29903/getdatasheetpartid-773702-29903807.pdf?src-supplier=Verical; ComponentLink2Description: https://datasheet.ciiva.com/29903/getdatasheetpartid-773702-29903807.pdf?src-supplier=Verical; ComponentLink3URL: https://datasheet.ciiva.com/14920/pts645-14920741.pdf?src-supplier=Digikey; ComponentLink3Description: https://datasheet.ciiva.com/14920/pts645-14920741.pdf?src-supplier=Digikey; ComponentLink4URL: https://datasheet.ciiva.com/22637/1707731-22637356.pdf?src-supplier=Element14; ComponentLink4Description: https://datasheet.ciiva.com/22637/1707731-22637356.pdf?src-supplier=Element14; LCSC Part Number: C221869
U1 = ESP32-S3-WROOM-1-N8: <a href="https://pricing.snapeda.com/parts/ESP32S3WROOM1N8R8/Espressif%20Systems/view-part?ref=eda">Check availability</a>  <a href="https://pricing.snapeda.com/parts/ESP32-S3-WROOM-1-N8R8/Espressif%20Systems/view-part?ref=eda">Check availability</a>; MF: {'manufacturer': u'Espressif Systems'}; Package: None; Price: None; Value: *; MP: ESP32-S3-WROOM-1-N8; Availability: Unavailable
U2 = GY-91: pin to pad: 3V3>2 CSB>8 GND>3 NCS>7 SCL>4 SDA>5 SDD/SAO>6 VIN>1
U3 = LM2596S-3.3/NOPB: SIMPLE SWITCHERÂ® 4.5V to 40V, 3A Low Component Count Step-Down Regulator 5-DDPAK/TO-263; MF: Texas Instruments; SnapEDA_Link: https://www.snapeda.com/parts/LM2596S-3.3/Texas+Instruments/view-part/?ref=snap; Package: TO-263-5 Texas Instruments; Value: *; MP: LM2596S-3.3; Check_prices: https://www.snapeda.com/parts/LM2596S-3.3/Texas+Instruments/view-part/?ref=eda
U4 = FT231XQ-R: IC USB SERIAL FULL UART 20QFN; Manufacturer: FTDI; Power Supplies: 3.3/5V; Max Supply Current: 8.4mA; Max Supply Voltage: 5.5V; Min Supply Voltage: 2.97V; Nominal Supply Voltage: 5V; Qualification Status: Not Qualified; Supplier: Digikey; Supplier Part Number: 768-1128-1-ND; Manufacturer Part Number: FT231XQ-R; RoHS: Yes; Category: Interface ICs; Stock: 77572; Pricing: 1=2.34, 25=2.27, 100=2.2, 250=2, 500=1.82002, 1000=1.7625 (USD); Case/Package: HVQCCN; Pins: 20; Package Shape: Square; Min Operating Temperature: -40°C; Max Operating Temperature: 85°C; JESD-30 Code: S-XQCC-N20; Package Style: CHIP CARRIER, HEAT SINK/SLUG, VERY THIN PROFILEMeter; Surface Mount: Yes; Technology: CMOS; Terminal Form: No Lead; Terminal Position: QUAD; Length: 4mm; Width: 4mm; Height - Seated (Max): 0.8mm; Terminal Pitch: 0.5mm; Temperature Grade: INDUSTRIAL; Reach SVHC Compliant: Yes; RoHS Compliant: Yes; ComponentLink1URL: https://datasheet.ciiva.com:443/pdfs/VipMasterIC/IC/FTDI/FTDIS00099/FTDIS00099-1.pdf?src-supplier=IHS+Markit; ComponentLink1Description: https://datasheet.ciiva.com:443/pdfs/VipMasterIC/IC/FTDI/FTDIS00099/FTDIS00099-1.pdf?src-supplier=IHS+Markit; ComponentLink2URL: https://datasheet.ciiva.com/1787/ds-ft231x-1787312.pdf?src-supplier=Digikey; ComponentLink2Description: https://datasheet.ciiva.com/1787/ds-ft231x-1787312.pdf?src-supplier=Digikey; ComponentLink3URL: https://datasheet.ciiva.com/4787/ds-ft231x-13571-4787570.pdf?src-supplier=Mouser; ComponentLink3Description: https://datasheet.ciiva.com/4787/ds-ft231x-13571-4787570.pdf?src-supplier=Mouser; ComponentLink4URL: https://datasheet.ciiva.com/30475/0900766b811020d3-30475405.pdf?src-supplier=Rs; ComponentLink4Description: https://datasheet.ciiva.com/30475/0900766b811020d3-30475405.pdf?src-supplier=Rs; ComponentLink5URL: https://datasheet.ciiva.com/1787/ft-x-series-1787313.pdf?src-supplier=Digikey; ComponentLink5Description: https://datasheet.ciiva.com/1787/ft-x-series-1787313.pdf?src-supplier=Digikey; ComponentLink6URL: https://datasheet.ciiva.com/1787/ft-x-series-1787314.pdf?src-supplier=Digikey; ComponentLink6Description: https://datasheet.ciiva.com/1787/ft-x-series-1787314.pdf?src-supplier=Digikey; LCSC Part Number: C132159
VR1 = LM2596S-5.0: SIMPLE SWITCHERÂ® 4.5V to 40V, 3A Low Component Count Step-Down Regulator; MF: Texas Instruments; MP: LM2596S-5.0/NOPB; SnapEDA_Link: https://www.snapeda.com/parts/LM2596S-5.0/NOPB/Texas+Instruments/view-part/?ref=snap; Package: TO-263-5 Texas Instruments; Value: *; Check_prices: https://www.snapeda.com/parts/LM2596S-5.0/NOPB/Texas+Instruments/view-part/?ref=eda